# Altium schematic sheet Main.SchDoc
size A4
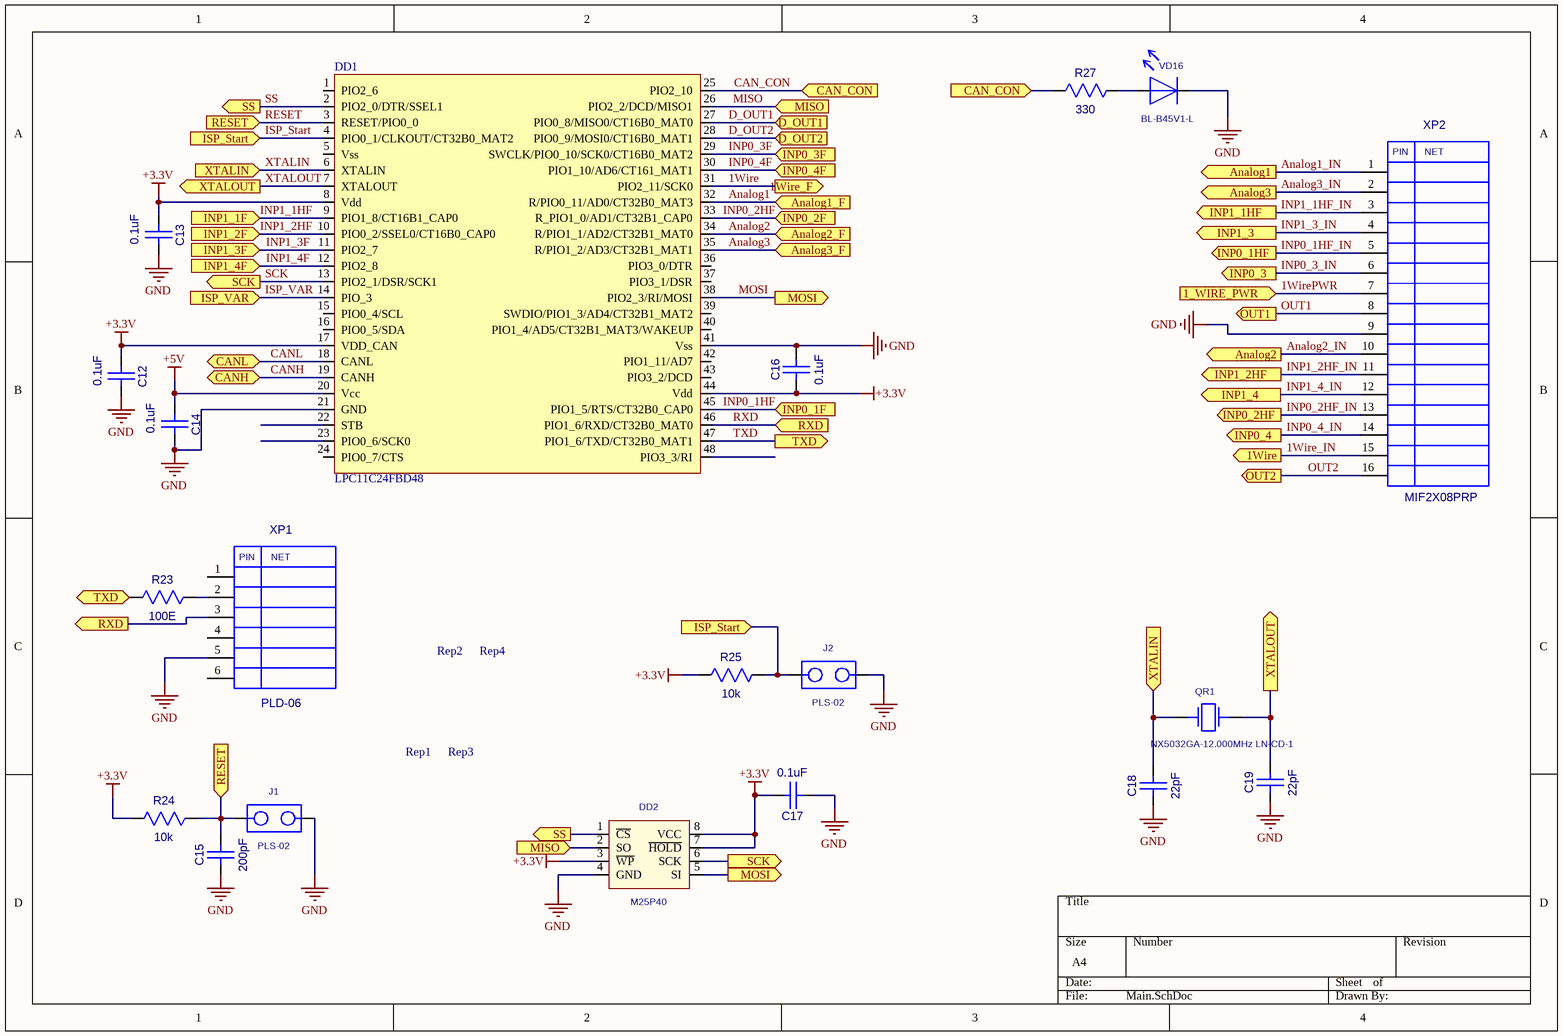
[diagram p0: Main.SchDoc]

## Parts
C12  0.1uF  [CC0603-3M]
C13  0.1uF  [CC0603-3M]
C14  0.1uF  [CC0603-3M]
C15  200pF  [CC0603-3M]
C16  0.1uF  [CC0603-3M]
C17  0.1uF  [CC0603-3M]
C18  22pF  [CC0603-3M]
C19  22pF  [CC0603-3M]
DD1  LPC11C24FBD48  [LQFP48]
DD2  M25P40  [EIAJ_SO8]
J1  PLS-02  [PIN2W]
J2  PLS-02  [PIN2W]
QR1  NX5032GA-12.000MHz LN-CD-1  [AC5032_2]
R23  100E  [RC0603-3M]
R24  10k  [RC0603-3M]
R25  10k  [RC0603-3M]
R27  330  [RC0603-3M]
Rep1  REPER1.2  [REPER1.2]  (value not drawn)
Rep2  REPER1.2  [REPER1.2]  (value not drawn)
Rep3  REPER1.2  [REPER1.2]  (value not drawn)
Rep4  REPER1.2  [REPER1.2]  (value not drawn)
VD16  BL-B45V1-L  [LED3]
XP1  PLD-06  [PIN6]
XP2  MIF2X08PRP  [MIF2X08PRP]

## Ports
1_WIRE_PWR (in), 1Wire (out), 1Wire_F (out), Analog1 (out), Analog1_F (in), Analog2 (out), Analog2_F (in), Analog3 (out), Analog3_F (in), CAN_CON (in), CANH, CANL, D_OUT1 (in), D_OUT2 (in), INP0_1F (in), INP0_1HF (out), INP0_2F (in), INP0_2HF (out), INP0_3 (out), INP0_3F (in), INP0_4 (out), INP0_4F (in), INP1_1F (in), INP1_1HF (out), INP1_2F (in), INP1_2HF (out), INP1_3 (out), INP1_3F (in), INP1_4 (out), INP1_4F (in), ISP_Start (in), ISP_VAR (in), MISO (in), MOSI (out), OUT1 (out), OUT2 (out), RESET (in), RXD (in), RXD (out), SCK (out), SS (out), TXD (in), TXD (out), XTALIN (in), XTALOUT (out)

## Nets
+3.3V: C12.1(A) C13.1(A) C16.1(A) C17.2(B) DD1.8(Vdd) DD1.17(VDD_CAN) DD1.44(Vdd) DD2.3(~{WP}) DD2.7(~{HOLD}) DD2.8(VCC) R24.1(A) R25.1(A)
+5V: C14.1(A) DD1.20(Vcc)
GND: C12.2(B) C13.2(B) C14.2(B) C15.1(A) C16.2(B) C17.1(A) C18.1(A) C19.1(A) DD1.21(GND) DD1.41(Vss) DD2.4(GND) J1.2 J2.2 VD16.1 XP1.5 XP2.9
1Wire: DD1.31(PIO2_11/SCK0) ; port 1Wire_F
1Wire_IN: XP2.15 ; port 1Wire
1WirePWR: XP2.7 ; port 1_WIRE_PWR
Analog1: DD1.32(R/PIO0_11/AD0/CT32B0_MAT3) ; port Analog1_F
Analog1_IN: XP2.1 ; port Analog1
Analog2: DD1.34(R/PIO1_1/AD2/CT32B1_MAT0) ; port Analog2_F
Analog2_IN: XP2.10 ; port Analog2
Analog3: DD1.35(R/PIO1_2/AD3/CT32B1_MAT1) ; port Analog3_F
Analog3_IN: XP2.2 ; port Analog3
CAN_CON: DD1.25(PIO2_10) R27.1(A) ; port CAN_CON
CANH: DD1.19(CANH) ; port CANH
CANL: DD1.18(CANL) ; port CANL
D_OUT1: DD1.27(PIO0_8/MISO0/CT16B0_MAT0) ; port D_OUT1
D_OUT2: DD1.28(PIO0_9/MOSI0/CT16B0_MAT1) ; port D_OUT2
INP0_1HF: DD1.45(PIO1_5/RTS/CT32B0_CAP0) ; port INP0_1F
INP0_1HF_IN: XP2.5 ; port INP0_1HF
INP0_2HF: DD1.33(R_PIO1_0/AD1/CT32B1_CAP0) ; port INP0_2F
INP0_2HF_IN: XP2.13 ; port INP0_2HF
INP0_3_IN: XP2.6 ; port INP0_3
INP0_3F: DD1.29(SWCLK/PIO0_10/SCK0/CT16B0_MAT2) ; port INP0_3F
INP0_4_IN: XP2.14 ; port INP0_4
INP0_4F: DD1.30(PIO1_10/AD6/CT161_MAT1) ; port INP0_4F
INP1_1HF: DD1.9(PIO1_8/CT16B1_CAP0) ; port INP1_1F
INP1_1HF_IN: XP2.3 ; port INP1_1HF
INP1_2HF: DD1.10(PIO0_2/SSEL0/CT16B0_CAP0) ; port INP1_2F
INP1_2HF_IN: XP2.11 ; port INP1_2HF
INP1_3_IN: XP2.4 ; port INP1_3
INP1_3F: DD1.11(PIO2_7) ; port INP1_3F
INP1_4_IN: XP2.12 ; port INP1_4
INP1_4F: DD1.12(PIO2_8) ; port INP1_4F
ISP_Start: DD1.4(PIO0_1/CLKOUT/CT32B0_MAT2) J2.1 R25.2(B) ; port ISP_Start
ISP_VAR: DD1.14(PIO_3) ; port ISP_VAR
MISO: DD1.26(PIO2_2/DCD/MISO1) DD2.2(SO) ; port MISO
MOSI: DD1.38(PIO2_3/RI/MOSI) DD2.5(SI) ; port MOSI
OUT1: XP2.8 ; port OUT1
OUT2: XP2.16 ; port OUT2
RESET: C15.2(B) DD1.3(RESET/PIO0_0) J1.1 R24.2(B) ; port RESET
RXD: DD1.46(PIO1_6/RXD/CT32B0_MAT0) XP1.3 ; port RXD
SCK: DD1.13(PIO2_1/DSR/SCK1) DD2.6(SCK) ; port SCK
SS: DD1.2(PIO2_0/DTR/SSEL1) DD2.1(~{CS}) ; port SS
TXD: DD1.47(PIO1_6/TXD/CT32B0_MAT1) R23.1(A) ; port TXD
XTALIN: C18.2(B) DD1.6(XTALIN) QR1.1 ; port XTALIN
XTALOUT: C19.2(B) DD1.7(XTALOUT) QR1.2 ; port XTALOUT
NetR23_2: R23.2(B) XP1.2
NetR27_2: R27.2(B) VD16.2

Not connected (* = marked no-connect by the designer): DD1 1(PIO2_6) 5(Vss) 15(PIO0_4/SCL) 16(PIO0_5/SDA) 22(STB) 23(PIO0_6/SCK0) 24(PIO0_7/CTS) 36(PIO3_0/DTR) 37(PIO3_1/DSR) 39(SWDIO/PIO1_3/AD4/CT32B1_MAT2) 40(PIO1_4/AD5/CT32B1_MAT3/WAKEUP) 42(PIO1_11/AD7) 43(PIO3_2/DCD) 48(PIO3_3/RI); Rep1 1; Rep2 1; Rep3 1; Rep4 1; XP1 1 4 6

## Notes on the sheet
- (in symbol MIF2X08PRP) PIN; NET
- (in symbol PLD-06) PIN; NET

## Library data of the parts
C12-C19 = CC0603
  C12-C14 C16 C17: Value: 0.1uF
  C15: Value: 200pF
  C18 C19: Value: 22pF
DD2 = S25FL016A0LMFI01: Value: M25P40
QR1 = AC5032_2: AC5032/2; Value: NX5032GA-12.000MHz LN-CD-1
R23-R25 R27 = RC0603
  R23: Value: 100E
  R24 R25: Value: 10k
  R27: Value: 330
VD16 = LED_3: Value: BL-B45V1-L
XP1 = PLD-06: PLD06; Value: *
DD1 = LPC11C24FBD48: Value: LPC11C24FBD48
J1 J2 = PLS-02: Value: *
Rep1-Rep4 = REPER1.2: Value: *
XP2 = MIF2X08PRP: Value: *